# Altium project MCU098_LP-MSPM0G3507.PrjPcb (part 2 of 4)

## Sheet MCU098_02_BoosterPack_Connectors.SchDoc: BoosterPack Connectors
size 431 x 279 mm; Date: Not shown in title block; ApprovedBy: Not shown in title block; CheckedBy: Not shown in title block; Author: Not shown in title block; CompanyName: Not shown in title block; DrawnBy: Johnson He; Engineer: Not shown in title block; Organization: Not shown in title block; Address1: Not shown in title block; Address2: Not shown in title block; Address3: Not shown in title block; Address4: Not shown in title block; DocumentNumber: 1; Revision: Use project parameter SCH_Rev; SheetNumber: 2; SheetTotal: 7; PageSetup: Record=PageOptions|CenterHorizontal=True|CenterVertical=True|PrintScale=1.00|XCorrection=1.00|YCorrection=1.00|PrintKind=0|BorderSize=5000000|LeftOffset=0|BottomOffset=0|Orientation=2|PaperLength=1000|PaperWidth=1000|Scale=100|PaperSource=15|PrintQuality=600|MediaType=1|DitherType=10|PaperKind=Letter|PrintScaleMode=1; CurrentTime: Not shown in title block; CurrentDate: Not shown in title block; Time: Not shown in title block; DocumentFullPathAndName: Not shown in title block; DocumentName: Not shown in title block; ModifiedDate: Not shown in title block; ImagePath: Not shown in title block
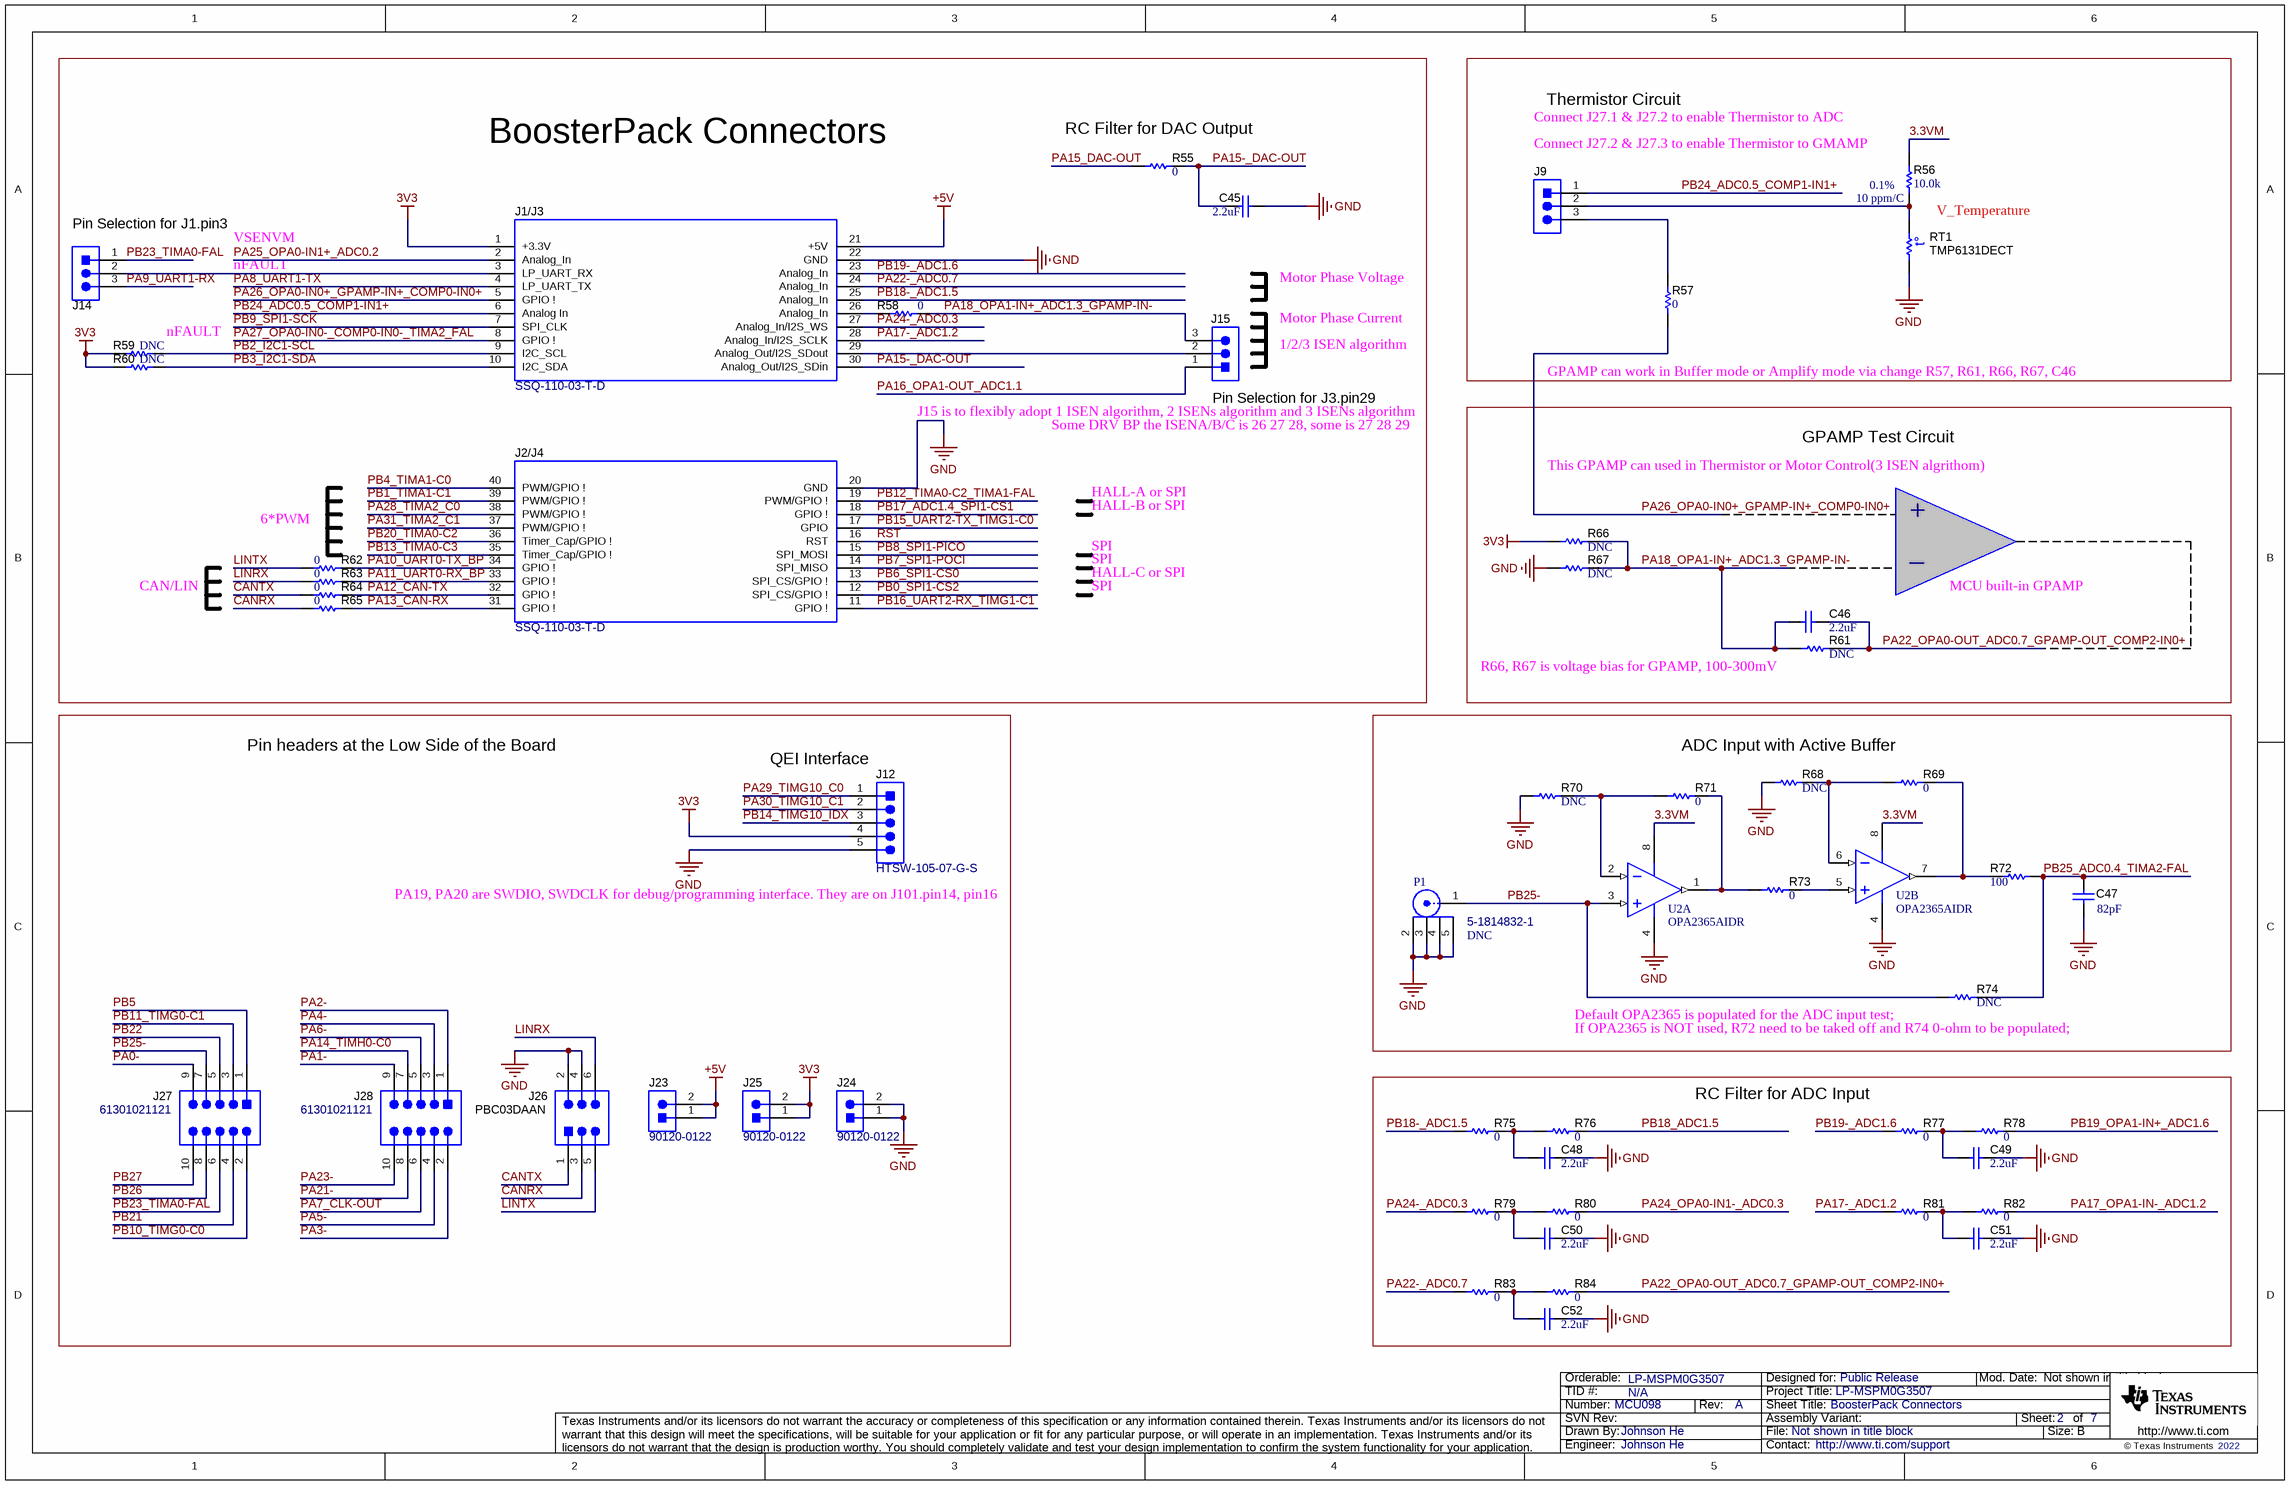
[diagram p1: MCU098_02_BoosterPack_Connectors.SchDoc]

### Parts
C45  ValueDisplayed: 2.2uF  [0603]  (hidden comment: C0603C225K8PACTU)  (no BOM)
C46  ValueDisplayed: 2.2uF  [0603]  (hidden comment: C0603C225K8PACTU)  (no BOM)
C47  ValueDisplayed: 82pF  [0603]  (hidden comment: C0603C820K5GACTU)
C48  ValueDisplayed: 2.2uF  [0603]  (hidden comment: C0603C225K8PACTU)  (no BOM)
C49  ValueDisplayed: 2.2uF  [0603]  (hidden comment: C0603C225K8PACTU)  (no BOM)
C50  ValueDisplayed: 2.2uF  [0603]  (hidden comment: C0603C225K8PACTU)  (no BOM)
C51  ValueDisplayed: 2.2uF  [0603]  (hidden comment: C0603C225K8PACTU)  (no BOM)
C52  ValueDisplayed: 2.2uF  [0603]  (hidden comment: C0603C225K8PACTU)  (no BOM)
J1/J3  SSQ-110-03-T-D  [BoosterPack_40pin_J1J3]
J2/J4  SSQ-110-03-T-D  [BoosterPack_40pin_J2J4]
J9  PEC03SAAN  [CONN_PEC03SAAN]  (value not drawn)
J12  HTSW-105-07-G-S  [Samtec_HTSW-105-07-G-S]  (net tie, no BOM)
J14  PEC03SAAN  [CONN_PEC03SAAN]  (value not drawn)
J15  PEC03SAAN  [CONN_PEC03SAAN]  (value not drawn)
J23  90120-0122  [CONN_90120-0122]  (no BOM)
J24  90120-0122  [CONN_90120-0122]  (no BOM)
J25  90120-0122  [CONN_90120-0122]  (no BOM)
J26  PBC03DAAN  [Sullins_PBC03DAAN]  (no BOM)
J27  61301021121  [WURTH_61301021121]  (no BOM)
J28  61301021121  [WURTH_61301021121]  (no BOM)
P1  5-1814832-1  ValueDisplayed: DNC  [TE_5-1814832-1]  (no BOM)
R55  ValueDisplayed: 0  [0603]  (hidden comment: RC0603JR-070RL)
R56  Tolerance_%: 0.1%  TempCo: 10 ppm/C  ValueDisplayed: 10.0k  [ERA3A]  (hidden comment: ERA3ARB103V)
R57  ValueDisplayed: 0  [0603]  (hidden comment: RC0603JR-070RL)
R58  ValueDisplayed: 0  [0603]  (hidden comment: RC0603JR-070RL)
R59  ValueDisplayed: DNC  [0402]  (hidden comment: CRCW04024K70JNED)  (no BOM)
R60  ValueDisplayed: DNC  [0402]  (hidden comment: CRCW04024K70JNED)  (no BOM)
R61  ValueDisplayed: DNC  [0603]  (hidden comment: RC0603JR-070RL)  (no BOM)
R62  ValueDisplayed: 0  [0603]  (hidden comment: RC0603JR-070RL)
R63  ValueDisplayed: 0  [0603]  (hidden comment: RC0603JR-070RL)
R64  ValueDisplayed: 0  [0603]  (hidden comment: RC0603JR-070RL)
R65  ValueDisplayed: 0  [0603]  (hidden comment: RC0603JR-070RL)
R66  ValueDisplayed: DNC  [0603]  (hidden comment: RC0603JR-070RL)  (no BOM)
R67  ValueDisplayed: DNC  [0603]  (hidden comment: RC0603JR-070RL)  (no BOM)
R68  ValueDisplayed: DNC  [0603]  (hidden comment: RC0603JR-070RL)  (no BOM)
R69  ValueDisplayed: 0  [0603]  (hidden comment: RC0603JR-070RL)
R70  ValueDisplayed: DNC  [0603]  (hidden comment: RC0603JR-070RL)  (no BOM)
R71  ValueDisplayed: 0  [0603]  (hidden comment: RC0603JR-070RL)
R72  ValueDisplayed: 100  [0603]  (hidden comment: RC0603FR-07100RL)
R73  ValueDisplayed: 0  [0603]  (hidden comment: RC0603JR-070RL)
R74  ValueDisplayed: DNC  [0603]  (hidden comment: RC0603JR-070RL)  (no BOM)
R75  ValueDisplayed: 0  [0603]  (hidden comment: RC0603JR-070RL)
R76  ValueDisplayed: 0  [0603]  (hidden comment: RC0603JR-070RL)
R77  ValueDisplayed: 0  [0603]  (hidden comment: RC0603JR-070RL)
R78  ValueDisplayed: 0  [0603]  (hidden comment: RC0603JR-070RL)
R79  ValueDisplayed: 0  [0603]  (hidden comment: RC0603JR-070RL)
R80  ValueDisplayed: 0  [0603]  (hidden comment: RC0603JR-070RL)
R81  ValueDisplayed: 0  [0603]  (hidden comment: RC0603JR-070RL)
R82  ValueDisplayed: 0  [0603]  (hidden comment: RC0603JR-070RL)
R83  ValueDisplayed: 0  [0603]  (hidden comment: RC0603JR-070RL)
R84  ValueDisplayed: 0  [0603]  (hidden comment: RC0603JR-070RL)
RT1  TMP6131DECT  [DEC0002A]
U2  OPA2365AIDR  [D0008A_L]  (parts A,B of 2)

### Blocks framed on the sheet
BoosterPack Connectors: C45 J1/J3 J2/J4 J14 J15 R55 R58-R60 R62-R65
Thermistor Circuit: J9 R56 R57 RT1
ADC Input with Active Buffer: C47 P1 R68-R74 U2
RC Filter for ADC Input: C48-C52 R75-R84

### Nets
3V3: J1/J3.1(+3.3V) J12.4 J25.1 J25.2 R59.1 R60.1 R66.1
+5V: J1/J3.21(+5V) J23.1 J23.2
GND: C45.2 C47.2 C48.2 C49.2 C50.2 C51.2 C52.2 J1/J3.22(GND) J2/J4.20(GND) J12.5 J24.1 J24.2 J26.2 J26.4 P1.2 P1.3 P1.4 P1.5 R67.1 R68.1 R70.1 RT1.1 U2.4(V-)
3.3VM: R56.2 U2.8(V+)
CANRX: J26.3 R65.1
CANTX: J26.1 R64.1
LINRX: J26.6 R63.1
LINTX: J26.5 R62.1
PA0-: J27.9
PA1-: J28.9
PA2-: J28.1
PA3-: J28.2
PA4-: J28.3
PA5-: J28.4
PA6-: J28.5
PA7_CLK-OUT: J28.6
PA8_UART1-TX: J1/J3.4(LP_UART_TX)
PA9_UART1-RX: J14.3
PA10_UART0-TX_BP: J2/J4.34(GPIO_!) R62.2
PA11_UART0-RX_BP: J2/J4.33(GPIO_!) R63.2
PA12_CAN-TX: J2/J4.32(GPIO_!) R64.2
PA13_CAN-RX: J2/J4.31(GPIO_!) R65.2
PA14_TIMH0-C0: J28.7
PA15-_DAC-OUT: C45.1 J1/J3.30(Analog_Out/I2S_SDin) R55.2
PA15_DAC-OUT: R55.1
PA16_OPA1-OUT_ADC1.1: J15.1
PA17-_ADC1.2: J1/J3.28(Analog_In/I2S_SCLK) R81.1
PA17_OPA1-IN-_ADC1.2: R82.2
PA18_OPA1-IN+_ADC1.3_GPAMP-IN-: C46.1 J15.3 R58.2 R61.1 R66.2 R67.2
PA21-: J28.8
PA22-_ADC0.7: J1/J3.24(Analog_In) R83.1
PA22_OPA0-OUT_ADC0.7_GPAMP-OUT_COMP2-IN0+: C46.2 R61.2 R84.2
PA23-: J28.10
PA24-_ADC0.3: J1/J3.27(Analog_In/I2S_WS) R79.1
PA24_OPA0-IN1-_ADC0.3: R80.2
PA25_OPA0-IN1+_ADC0.2: J1/J3.2(Analog_In)
PA26_OPA0-IN0+_GPAMP-IN+_COMP0-IN0+: J1/J3.5(GPIO_!) R57.1
PA27_OPA0-IN0-_COMP0-IN0-_TIMA2_FAL: J1/J3.8(GPIO_!)
PA28_TIMA2_C0: J2/J4.38(PWM/GPIO_!)
PA29_TIMG10_C0: J12.1
PA30_TIMG10_C1: J12.2
PA31_TIMA2_C1: J2/J4.37(PWM/GPIO_!)
PB0_SPI1-CS2: J2/J4.12(SPI_CS/GPIO_!)
PB1_TIMA1-C1: J2/J4.39(PWM/GPIO_!)
PB2_I2C1-SCL: J1/J3.9(I2C_SCL) R59.2
PB3_I2C1-SDA: J1/J3.10(I2C_SDA) R60.2
PB4_TIMA1-C0: J2/J4.40(PWM/GPIO_!)
PB5: J27.1
PB6_SPI1-CS0: J2/J4.13(SPI_CS/GPIO_!)
PB7_SPI1-POCI: J2/J4.14(SPI_MISO)
PB8_SPI1-PICO: J2/J4.15(SPI_MOSI)
PB9_SPI1-SCK: J1/J3.7(SPI_CLK)
PB10_TIMG0-C0: J27.2
PB11_TIMG0-C1: J27.3
PB12_TIMA0-C2_TIMA1-FAL: J2/J4.19(PWM/GPIO_!)
PB13_TIMA0-C3: J2/J4.35(Timer_Cap/GPIO_!)
PB14_TIMG10_IDX: J12.3
PB15_UART2-TX_TIMG1-C0: J2/J4.17(GPIO)
PB16_UART2-RX_TIMG1-C1: J2/J4.11(GPIO_!)
PB17_ADC1.4_SPI1-CS1: J2/J4.18(GPIO_!)
PB18-_ADC1.5: J1/J3.25(Analog_In) R75.1
PB18_ADC1.5: R76.2
PB19-_ADC1.6: J1/J3.23(Analog_In) R77.1
PB19_OPA1-IN+_ADC1.6: R78.2
PB20_TIMA0-C2: J2/J4.36(Timer_Cap/GPIO_!)
PB21: J27.4
PB22: J27.5
PB23_TIMA0-FAL: J14.1 J27.6
PB24_ADC0.5_COMP1-IN1+: J1/J3.6(Analog_In) J9.1
PB25-: J27.7 P1.1 R74.1 U2.3(IN_A+)
PB25_ADC0.4_TIMA2-FAL: C47.1 R72.2 R74.2
PB26: J27.8
PB27: J27.10
~{RST}: J2/J4.16(RST)
NetC48_1: C48.1 R75.2 R76.1
NetC49_1: C49.1 R77.2 R78.1
NetC50_1: C50.1 R79.2 R80.1
NetC51_1: C51.1 R81.2 R82.1
NetC52_1: C52.1 R83.2 R84.1
NetJ1/J3_3: J1/J3.3(LP_UART_RX) J14.2
NetJ1/J3_26: J1/J3.26(Analog_In) R58.1
NetJ1/J3_29: J1/J3.29(Analog_Out/I2S_SDout) J15.2
NetJ9_2: J9.2 R56.1 RT1.2
NetJ9_3: J9.3 R57.2
NetR68_2: R68.2 R69.1 U2.6(IN_B-)
NetR69_2: R69.2 R72.1 U2.7(VOUT_B)
NetR70_2: R70.2 R71.1 U2.2(IN_A-)
NetR71_2: R71.2 R73.1 U2.1(VOUT_A)
NetR73_2: R73.2 U2.5(IN_B+)

### Notes on the sheet
- (near R55) RC Filter for DAC Output
- Connect J27.1 & J27.2 to enable Thermistor to ADC
- (near R56) Connect J27.2 & J27.3 to enable Thermistor to GMAMP
- (near J14) Pin Selection for J1.pin3
- V_Temperature
- VSENVM
- nFAULT
- Motor Phase Voltage
- Motor Phase Current
- 1/2/3 ISEN algorithm
- (near J15) J15 is to flexibly adopt 1 ISEN algorithm, 2 ISENs algorithm and 3 ISENs algorithm
- (near J15) Some DRV BP the ISENA/B/C is 26 27 28, some is 27 28 29
- (near J15) Pin Selection for J3.pin29
- (near R57) GPAMP can work in Buffer mode or Amplify mode via change R57, R61, R66, R67, C46
- HALL-A or SPI
- This GPAMP can used in Thermistor or Motor Control(3 ISEN algrithom)
- GPAMP Test Circuit
- 6*PWM
- HALL-B or SPI
- SPI
- _
- +
- CAN/LIN
- HALL-C or SPI
- MCU built-in GPAMP
- (near R61) R66, R67 is voltage bias for GPAMP, 100-300mV
- Pin headers at the Low Side of the Board
- (near J12) QEI Interface
- (near J12) PA19, PA20 are SWDIO, SWDCLK for debug/programming interface. They are on J101.pin14, pin16
- (near R74) Default OPA2365 is populated for the ADC input test;
- (near R74) If OPA2365 is NOT used, R72 need to be taked off and R74 0-ohm to be populated;
- Drawn By:
- SVN Rev:
- Number:
- TID #:
- Orderable:
- Rev:
- Sheet Title:
- File:
- Project Title:
- Designed for:
- Assembly Variant:
- Mod. Date:
- Sheet:
- Size:
- of
- B
- http://www.ti.com
- Texas Instruments and/or its licensors do not warrant the accuracy or completeness of this specification or any information contained therein. Texas Instruments and/or its licensors do not warrant that this design will meet the specifications, will be suitable for your application or fit for any particular purpose, or will operate in an implementation. Texas Instruments and/or its licensors do not warrant that the design is production worthy. You should completely validate and test your design implementation to confirm the system functionality for your application.
- Engineer:
- Contact:
- © Texas Instruments
- (in symbol CMP-0084565-1) t°

### Library data of the parts
C45 C46 C48-C52 = CMP-0006906-5: CAP, CERM, 2.2 uF, 10 V, +/- 10%, X5R, 0603; Manufacturer: Kemet; TaMin_C: -55°C; Polarized: N; SizeAreaWB_mm2: 4.68; Value1: Unknown; U/M: EA; Value: 2.2uF; TaMax_C: 85°C; SizeZ_mm: 1; SizeX_mm: 1.6; SizeY_mm: 0.8; Value2: 10V; SizeArea_mm2: 1.28; Cap_F: 2.2µF; AEC Category: Q200; Publisher: Texas Instruments; TempCo: X5R; Published: 2008-06-19; RoHS: Y; MountType: SMT; Supplier 1: Digi-Key; PackageReference: 0603; Tolerance_%: 10%; Cap_Case: 0603; CompType: Capacitor; LatestRevisionDate: 2017-03-09; PartNumber: C0603C225K8PACTU; AEC Qualified: ?; VDC_V: 10V; ComponentLink1Description: Datasheet link; Supplier Part Number 1: 399-4911-1-ND; Technology: Ceramic; ComponentLink1URL: http://www.kemet.com/kemet/web/homepage/kechome.nsf/vapubfiles/F3102_Y5V.pdf/$file/F3102_Y5V.pdf; Supplier 2: Mouser; Supplier 3: Farnell; Supplier Part Number 2: 80-C0603C225K8P; Supplier Part Number 3: 1108322
C47 = CMP-0006970-1: CAP, CERM, 82 pF, 50 V, +/- 10%, C0G/NP0, 0603; Manufacturer: Kemet; TaMin_C: -55°C; Polarized: N; SizeAreaWB_mm2: 4.68; Value1: Unknown; U/M: EA; Value: 82pF; TaMax_C: 125°C; SizeZ_mm: 1; SizeX_mm: 1.6; SizeY_mm: 0.8; Value2: 50V; SizeArea_mm2: 1.28; AEC Category: Q200; ComponentLink1URL: http://www.kemet.com/kemet/web/homepage/kechome.nsf/vapubfiles/F3102_Y5V.pdf/$file/F3102_Y5V.pdf; Supplier Part Number 2: 80-C0603C820K5G; Publisher: Texas Instruments; Supplier 2: Mouser; TempCo: C0G/NP0; Published: 2008-06-19; RoHS: Y; MountType: SMT; Supplier 1: Digi-Key; PackageReference: 0603; Tolerance_%: 10%; Cap_Case: 0603; CompType: Capacitor; LatestRevisionDate: 2017-03-09; PartNumber: C0603C820K5GACTU; AEC Qualified: ?; Cap_F: 82pF; VDC_V: 50V; ComponentLink1Description: Datasheet link; Supplier Part Number 1: 399-1059-1-ND; Technology: Ceramic
J1/J3 = CMP-0003837-4: Receptacle, 2.54mm, 10x2, Tin, TH; Alternate PartNumber: CRD-081413-A-G; Manufacturer: Samtec; Alternate Manufacturer: Major League Electronics; Note: Booster Pack 40 pin J1 and J3; Green_Lifecycle: Active; Green_REACh: Incomplete; Supplier 1: Digi-Key; CompType: Receptacle; PackageReference: 10x2 Receptacle; RoHS: Y; Supplier Part Number 1: SAM1204-10-ND; MountType: TH; PartNumber: SSQ-110-03-T-D; ComponentLink1Description: Datasheet Link; ComponentLink1URL: https://www.samtec.com/ftppub/cpdf/SSQ-1XX-XX-XXX-X-XX-XXX-XX-X-MKT.pdf; Supplier 2: Newark; Supplier Part Number 2: 11P8392; Green_EU RoHS: Passed; Green_EU RoHS-2: Passed
J2/J4 = CMP-0078266-4: Receptacle, 2.54mm, 10x2, Tin, TH; Alternate PartNumber: CRD-081413-A-G; Manufacturer: Samtec; Alternate Manufacturer: Major League Electronics; Note: Booster Pack 40 pin J2 and J4; Green_REACh: Incomplete; Green_Lifecycle: Active; Green_EU RoHS-2: Passed; CompType: Receptacle; Supplier 1: Digi-Key; PackageReference: 10x2 Receptacle; RoHS: Y; Supplier Part Number 1: SAM1204-10-ND; PartNumber: SSQ-110-03-T-D; MountType: TH; ComponentLink1Description: Datasheet Link; Green_EU RoHS: Passed; ComponentLink1URL: https://www.samtec.com/ftppub/cpdf/SSQ-1XX-XX-XXX-X-XX-XXX-XX-X-MKT.pdf; Supplier 2: Newark; Supplier Part Number 2: 11P8392
J9 J14 J15 = CMP-0002338-1: Header, 100mil, 3x1, Tin, TH; Manufacturer: Sullins Connector Solutions; CNHeader: TRUE; Current_A: 3A; Green_Lifecycle: Not Set; Shrouded: N; Gender: Male; Green_REACh: Incomplete; Voltage_V: 1.8kV; Row_Count: 1; Pitch_mm: 2.54; CT: FALSE; Cert_UL: Y; ComponentLink1URL: http://www.sullinscorp.com/catalogs/77_PAGE108-109_.100_MALE_HDR.pdf; ClassName: Header; Publisher: Texas Instruments; Color: Black; RoHS: Y; MountType: TH; Green_EU RoHS-2: Incomplete; Supplier 1: Digi-Key; Green_EU RoHS: Incomplete; PackageReference: Header, 3 PIN, 100mil, Tin; PinCount: 3; CompType: Header; LatestRevisionDate: 26/05/2017; PartNumber: PEC03SAAN; Orientation: Vertical; ComponentLink1Description: Datasheet URL; Supplier Part Number 1: S1012E-03-ND; ContactFinish: Tin
J12 = CMP-0075485-1: Header, 100mil, 5x1, Gold, TH; Manufacturer: Samtec; Green_REACh: Passed; CT: False; Green_Lifecycle: Active; CNHeader: True; ComponentLink1Description: Datasheet URL; RoHS: Y; Supplier Part Number 3: 1926325; Supplier 1: Digi-Key; Green_EU RoHS: Passed; PackageReference: Header, 100mil, 5x1, TH; PartNumber: HTSW-105-07-G-S; Publisher: Texas Instruments; Supplier Part Number 2: 60R3871; Supplier 2: Newark; ClassName: Header; ComponentLink1URL: http://www.samtec.com/ftppub/pdf/TSW_TH.PDF; LatestRevisionDate: 2017-07-12; CompType: Header; MountType: TH; Supplier Part Number 1: SAM8737-ND; Supplier 3: Farnell; Green_EU RoHS-2: Passed
J23-J25 = CMP-0055312-1: Header, 100mil, 2x1, Tin, TH; Manufacturer: Molex; CNHeader: TRUE; Green_Lifecycle: Active; Green_REACh: Passed; CT: FALSE; ComponentLink1URL: http://www.molex.com/pdm_docs/sd/901200122_sd.pdf; ClassName: Header; Supplier Part Number 2: 19M8215; Publisher: Texas Instruments; Supplier 2: Newark; Supplier Part Number 3: 538-90120-0122; Supplier 3: Mouser; RoHS: Y; MountType: TH; Green_EU RoHS-2: Passed; Supplier 1: Digi-Key; Green_EU RoHS: Passed; PackageReference: Header 2x1; CompType: Header; LatestRevisionDate: 26/05/2017; PartNumber: 90120-0122; ComponentLink1Description: Datasheet URL; Supplier Part Number 1: WM8072-ND
J26 = CMP-0054565-2: Header, 100mil, 3x2, Gold, TH; Manufacturer: Sullins Connector Solutions; Current_A: 3A; Green_Lifecycle: Active; Shrouded: N; Gender: Male; Green_REACh: Passed; Voltage_V: 1.8kV; Row_Count: 2; RowSpacing_mm: 2.54; Cert_UL: Y; ComponentLink1URL: http://www.sullinscorp.com/catalogs/77_PAGE108-109_.100_MALE_HDR.pdf; ClassName: Header; Color: Black; RoHS: Y; MountType: TH; Green_EU RoHS-2: Passed; Supplier 1: Digi-Key; Green_EU RoHS: Passed; PackageReference: Sullins 100mil, 2x3, 230 mil above insulator; PinCount: 6; CompType: Header; PartNumber: PBC03DAAN; Orientation: Vertical; ComponentLink1Description: Datasheet URL; Supplier Part Number 1: S2011E-03-ND; Pitch_mm: 2.54; ContactFinish: Gold
J27 J28 = CMP-0054806-2: Header, 2.54 mm, 5x2, Gold, TH; Manufacturer: Wurth Elektronik; Green_Lifecycle: Active; Green_REACh: Passed; Cert_UL: Y; Current_A: 3A; Gender: Male; Pitch_mm: 2.54; Row_Count: 2; Shrouded: N; Voltage_V: 250V; ComponentLink1URL: http://katalog.we-online.de/em/datasheet/6130xx21121.pdf; ClassName: Header; Supplier Part Number 2: 16T0631; Supplier 2: Newark; Supplier Part Number 3: 710-61301021121; Supplier 3: Mouser; RoHS: Y; MountType: TH; Green_EU RoHS-2: Incomplete; Supplier 1: Digi-Key; Green_EU RoHS: Passed; PackageReference: Header, 2.54mm, 5x2, TH; CompType: Header; PartNumber: 61301021121; ComponentLink1Description: Datasheet URL; Supplier Part Number 1: 732-2672-ND; ContactFinish: Gold; Orientation: Vertical; PinCount: 10; RowSpacing_mm: 2.54
P1 = CMP-0054990-1: SMA Straight PCB Socket Die Cast, 50 Ohm, TH; Manufacturer: TE Connectivity; CNHeader: FALSE; Green_Lifecycle: Active; Green_REACh: Passed; CT: TRUE; ComponentLink1URL: http://www.te.com/commerce/DocumentDelivery/DDEController?Action=srchrtrv&DocNm=1814832&DocType=Customer+Drawing&DocLang=English; Supplier Part Number 2: 78M7270; Publisher: Texas Instruments; Supplier 2: Newark; Supplier Part Number 3: 571-5-1814832-1; Supplier 3: Mouser; RoHS: Y; MountType: TH; Green_EU RoHS-2: Incomplete; Supplier 1: Digi-Key; Green_EU RoHS: Passed with Exemption; PackageReference: SMA Straight PCB Socket Die Cast, TH; CompType: SMA; LatestRevisionDate: 26/05/2017; PartNumber: 5-1814832-1; ComponentLink1Description: Datasheet URL; Supplier Part Number 1: A97594-ND
R55 R57 R58 R61-R71 R73-R84 = CMP-0025885-5: RES, 0, 5%, 0.1 W, 0603; Manufacturer: Yageo; Power_W: 100mW; TempCo: 200 ppm/C; Value_Code: 0000; Value: 0; EIA_Code: E24; SizeX_mm: 1.6; SizeZ_mm: 1; Value2: 0.1W; SizeArea_mm2: 1.28; AEC Qualified: N; VDC_V: 75V; AEC Category: Q200; SizeY_mm: 0.8; SizeAreaWB_mm2: 4.68; Supplier Part Number 2: 603-RC0603JR-070RL; Supplier 2: Mouser; Supplier Part Number 3: 9233130; Supplier 3: Farnell; RoHS: Y; Value1: 5%; MountType: SMT; Supplier 1: Digi-Key; PackageReference: 0603; Tolerance_%: 5%; Res_ohm: 0; CompType: Resistor; PartNumber: RC0603JR-070RL; ComponentLink1Description: Datasheet link; Supplier Part Number 1: 311-0.0GRCT-ND; Technology: Thick Film; ComponentLink1URL: http://www.yageo.com/pdf/Pu-RC0603_51_PbFree_L_2.pdf; AEC Grade: N/A
R56 = CMP-0080084-1: RES, 10.0 k, 0.1%, 0.1 W, AEC-Q200 Grade 0, 1.6x0.8mm; Manufacturer: Panasonic; Value_Code: 10k0; SizeAreaWB_mm2: 4.68; SizeArea_mm2: 1.28; AEC Qualified: Y; AEC Category: Q200; Res_ohm: 10k; Value: 10.0k; SizeZ_mm: 0.55; AEC Grade: 0; Power_W: 100mW; VDC_V: 150V; SizeY_mm: 0.8; Value2: 0.1W; SizeX_mm: 1.6; ComponentLink1Description: Datasheet link; RoHS: Y; Supplier Part Number 3: 667-ERA-3ARB103V; Supplier 1: Digi-Key; PackageReference: 1.6x0.8mm; Technology: Thin Film; PartNumber: ERA3ARB103V; Supplier Part Number 2: 62W8891; Supplier 2: Newark; ComponentLink1URL: https://industrial.panasonic.com/cdbs/www-data/pdf/RDM0000/AOA0000C307.pdf; Value1: 0.1%; CompType: Resistor; MountType: SMT; Supplier Part Number 1: P10KBDCT-ND; Supplier 3: Mouser
R59 R60 = CMP-0026938-5: RES, 4.7 k, 5%, 0.063 W, AEC-Q200 Grade 0, 0402; Manufacturer: Vishay-Dale; Power_W: 63mW; TempCo: 200 ppm/C; Value_Code: 4k70; Value: 4.7k; EIA_Code: E24; SizeX_mm: 1; SizeY_mm: 0.5; SizeZ_mm: 0.6; Value2: 0.063W; AEC Qualified: Y; VDC_V: 50V; AEC Category: Q200; AEC Grade: 0; Supplier Part Number 2: 59M6733; Supplier 2: Newark; Supplier Part Number 3: 71-CRCW0402J-4.7K-E3; Supplier 3: Mouser; RoHS: E; Value1: 5%; MountType: SMT; Supplier 1: Digi-Key; PackageReference: 0402; Tolerance_%: 5%; Res_ohm: 4.7k; SizeArea_mm2: 0.5; CompType: Resistor; PartNumber: CRCW04024K70JNED; ComponentLink1Description: Datasheet link; Supplier Part Number 1: 541-4.7KJCT-ND; Technology: Thick Film; ComponentLink1URL: http://www.vishay.com/docs/20035/dcrcwe3.pdf
R72 = CMP-0022736-4: RES, 100, 1%, 0.1 W, 0603; Manufacturer: Yageo; Power_W: 100mW; TempCo: 100 ppm/C; Value_Code: 100R; Value: 100; EIA_Code: E96; SizeX_mm: 1.6; SizeY_mm: 0.8; SizeZ_mm: 1; Value2: 0.1W; SizeArea_mm2: 1.28; AEC Qualified: N; VDC_V: 75V; AEC Category: Q200; SizeAreaWB_mm2: 4.68; ComponentLink1URL: http://www.yageo.com/pdf/Pu-RC0603_51_PbFree_L_2.pdf; Supplier Part Number 2: 603-RC0603FR-07100RL; Supplier 2: Mouser; Supplier Part Number 3: 9238360; Supplier 3: Farnell; RoHS: Y; Value1: 1%; MountType: SMT; Supplier 1: Digi-Key; PackageReference: 0603; Tolerance_%: 1%; Res_ohm: 100; CompType: Resistor; PartNumber: RC0603FR-07100RL; ComponentLink1Description: Datasheet link; Supplier Part Number 1: 311-100HRCT-ND; Technology: Thick Film; AEC Grade: N/A
RT1 = CMP-0084565-1: Thermistor, DEC0002A (X1SON-2); Alternate Manufacturer: Texas Instruments; Alternate PartNumber: TMP6131DECR; SizeZ_mm: 0.5; CompType: IC; AEC Category: Q200; SizeArea_mm2: 0.6; AEC Qualified: N; SizeX_mm: 1; SizeAreaWB_mm2: 3.2; ComponentLink3Description: Online Datasheet; PackageReference: DEC0002A; ComponentLink2Description: Product Folder; ComponentLink3URL: http://www.ti.com/product/tmp6/datasheet; MountType: SMT; PackageDescription: X1SON-2; ComponentLink2URL: http://www.ti.com/product/tmp6; PartNumber: TMP6131DECT; ComponentLink1URL: http://www.ti.com/lit/ds/symlink/tmp6.pdf; ComponentLink1Description: Datasheet Link; SizeY_mm: 0.6; Manufacturer: Texas Instruments
U2 = CMP-0040798-2: 50 MHz, Low-Noise Single-Supply Rail-to-Rail Operational Amplifier, 2.2 to 5.5 V, -40 to 125 degC, 8-pin SOIC (D8), Green (RoHS & no Sb/Br); Manufacturer: Texas Instruments; Sub Family: High Speed Amplifier (>=50MHz), Low Input Bias Current Amp (<=10pA), Low Offset Voltage Amplifier (<=500uV), Low Supply Voltage Amplifier (<=2.7V); Total Supply Voltage(Min)(+5V is 5, +/-5V is 10): 2.2; Slew Rate(Typ)(V/us): 25; Vio (25C)(Max)(mV): 0.2; IIB(Max)(pA): 10; Total Supply Voltage(Max)(+5V is 5, +/-5V is 10): 5.5; Offset Drift(Typ)(uV/C): 1; Iq per channel(Max)(mA): 5; CMRR(Min)(dB): 100; Number of Channels: 2; ComponentLink1URL: http://www.ti.com/; Code_JEDEC: MS-012; PackageDescription: 8-Pin Plastic Small Outline, Body 4.9 x 3.9 mm, Pitch 1.27 mm; ComponentLink2URL: http://www.ti.com/general/docs/lit/getliterature.tsp?genericPartNumber=OPA2365&fileType=pdf; ComponentLink3Description: Package Specification; Eco-Plan: Green (RoHS & no Sb/Br); ComponentLink2Description: Datasheet; ComponentLink3URL: http://www.ti.com/litv/pdf/msoi002j; PackageReference: D0008A; DatasheetVersion: SBOS365D; PartNumber: OPA2365AIDR; PackageVersion: 4040047-3/M, 06/2011; ComponentLink1Description: Manufacturer URL; Mounting Technology: Surface Mount; PartId: 1

## Sheet MCU098_03_XDS110_Debug_Probe.SchDoc: XDS110-ET Debug Probe
size 431 x 279 mm; Date: Not shown in title block; ApprovedBy: Not shown in title block; CheckedBy: Not shown in title block; Author: Not shown in title block; CompanyName: Not shown in title block; DrawnBy: Johnson He; Engineer: Not shown in title block; Organization: Not shown in title block; Address1: Not shown in title block; Address2: Not shown in title block; Address3: Not shown in title block; Address4: Not shown in title block; DocumentNumber: 1; Revision: Use project parameter SCH_Rev; SheetNumber: 3; SheetTotal: 7; PageSetup: Record=PageOptions|CenterHorizontal=True|CenterVertical=True|PrintScale=1.00|XCorrection=1.00|YCorrection=1.00|PrintKind=0|BorderSize=5000000|LeftOffset=0|BottomOffset=0|Orientation=2|PaperLength=1000|PaperWidth=1000|Scale=100|PaperSource=15|PrintQuality=600|MediaType=1|DitherType=10|PaperKind=Letter|PrintScaleMode=1; CurrentTime: Not shown in title block; CurrentDate: Not shown in title block; Time: Not shown in title block; DocumentFullPathAndName: Not shown in title block; DocumentName: Not shown in title block; ModifiedDate: Not shown in title block; ImagePath: Not shown in title block
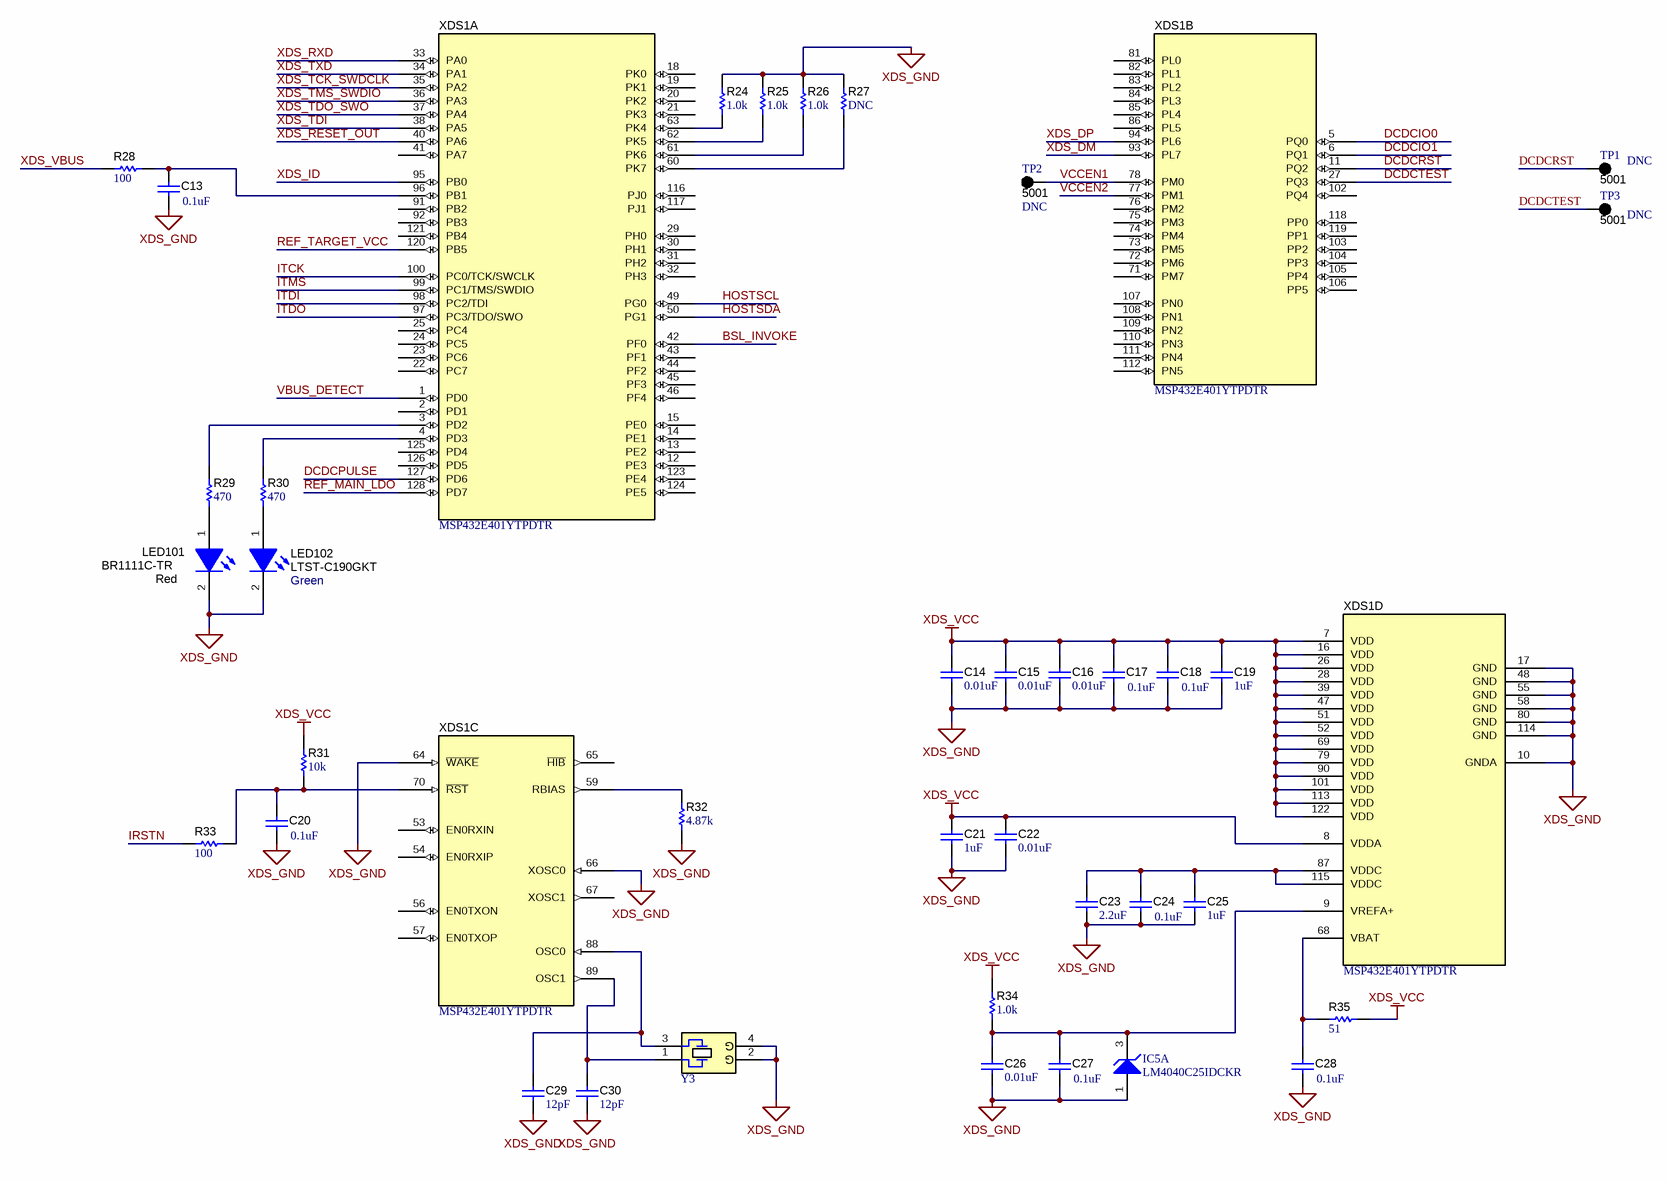
[diagram p2: MCU098_03_XDS110_Debug_Probe.SchDoc]

### Parts
C13  ValueDisplayed: 0.1uF  [0402]  (hidden comment: GRM155R70J104KA01D)
C14  ValueDisplayed: 0.01uF  [0402]  (hidden comment: GRM155R71E103KA01D)
C15  ValueDisplayed: 0.01uF  [0402]  (hidden comment: GRM155R71E103KA01D)
C16  ValueDisplayed: 0.01uF  [0402]  (hidden comment: GRM155R71E103KA01D)
C17  ValueDisplayed: 0.1uF  [0402]  (hidden comment: GRM155R70J104KA01D)
C18  ValueDisplayed: 0.1uF  [0402]  (hidden comment: GRM155R70J104KA01D)
C19  ValueDisplayed: 1uF  [0402]  (hidden comment: C1005X5R1E105K050BC)
C20  ValueDisplayed: 0.1uF  [0402]  (hidden comment: GRM155R70J104KA01D)
C21  ValueDisplayed: 1uF  [0402]  (hidden comment: C1005X5R1E105K050BC)
C22  ValueDisplayed: 0.01uF  [0402]  (hidden comment: GRM155R71E103KA01D)
C23  ValueDisplayed: 2.2uF  [0402]  (hidden comment: GRM155R60J225KE95D)
C24  ValueDisplayed: 0.1uF  [0402]  (hidden comment: GRM155R70J104KA01D)
C25  ValueDisplayed: 1uF  [0402]  (hidden comment: C1005X5R1E105K050BC)
C26  ValueDisplayed: 0.01uF  [0402]  (hidden comment: GRM155R71E103KA01D)
C27  ValueDisplayed: 0.1uF  [0402]  (hidden comment: GRM155R70J104KA01D)
C28  ValueDisplayed: 0.1uF  [0402]  (hidden comment: GRM155R70J104KA01D)
C29  ValueDisplayed: 12pF  [0402]  (hidden comment: GRM1555C1H120JA01D)
C30  ValueDisplayed: 12pF  [0402]  (hidden comment: GRM1555C1H120JA01D)
IC5  LM4040C25IDCKR  [DCK0005A_N]  (part A of 2)
LED101  BR1111C-TR  value Red  [1111C_Red]
LED102  LTST-C190GKT  value Green  [LED_LTST-C190]
R24  ValueDisplayed: 1.0k  [0402]  (hidden comment: CRCW04021K00JNED)
R25  ValueDisplayed: 1.0k  [0402]  (hidden comment: CRCW04021K00JNED)
R26  ValueDisplayed: 1.0k  [0402]  (hidden comment: CRCW04021K00JNED)
R27  ValueDisplayed: DNC  [0402]  (hidden comment: CRCW04021K00JNED)  (no BOM)
R28  ValueDisplayed: 100  [0402]  (hidden comment: CRCW0402100RJNED)
R29  ValueDisplayed: 470  [0402]  (hidden comment: CRCW0402470RJNED)
R30  ValueDisplayed: 470  [0402]  (hidden comment: CRCW0402470RJNED)
R31  ValueDisplayed: 10k  [0402]  (hidden comment: CRCW040210K0JNED)
R32  ValueDisplayed: 4.87k  [0402]  (hidden comment: CRCW04024K87FKED)
R33  ValueDisplayed: 100  [0402]  (hidden comment: CRCW0402100RJNED)
R34  ValueDisplayed: 1.0k  [0402]  (hidden comment: CRCW04021K00JNED)
R35  ValueDisplayed: 51  [0402]  (hidden comment: CRCW040251R0JNED)
TP1  5001  Display: DNC  [Keystone5001]  (no BOM)
TP2  5001  Display: DNC  [Keystone5001]  (no BOM)
TP3  5001  Display: DNC  [Keystone5001]  (no BOM)
XDS1  MSP432E401YTPDTR  [PDT0128A]  (parts A,B,C,D of 4)
Y3  NX3225GA-16.000M-STD-CRG-1  [NDK_NX3225GA]  (value not drawn)

### Nets
XDS_GND: C13.2 C14.2 C15.2 C16.2 C17.2 C18.2 C19.2 C20.2 C21.2 C22.2 C23.2 C24.2 C25.2 C26.2 C27.2 C28.2 C29.2 C30.2 IC5.1(ANODE) LED101.2(K) LED102.2(K) R24.2 R25.2 R26.2 R27.2 R32.1 XDS1.10(GNDA) XDS1.17(GND) XDS1.48(GND) XDS1.55(GND) XDS1.58(GND) XDS1.64(~{WAKE}) XDS1.66(XOSC0) XDS1.80(GND) XDS1.114(GND) Y3.2(GND) Y3.4(GND)
XDS_VCC: C14.1 C15.1 C16.1 C17.1 C18.1 C19.1 C21.1 C22.1 R31.2 R34.2 R35.2 XDS1.7(VDD) XDS1.8(VDDA) XDS1.16(VDD) XDS1.26(VDD) XDS1.28(VDD) XDS1.39(VDD) XDS1.47(VDD) XDS1.51(VDD) XDS1.52(VDD) XDS1.69(VDD) XDS1.79(VDD) XDS1.90(VDD) XDS1.101(VDD) XDS1.113(VDD) XDS1.122(VDD)
BSL_INVOKE: XDS1.42(PF0)
DCDCIO0: XDS1.5(PQ0)
DCDCIO1: XDS1.6(PQ1)
DCDCPULSE: XDS1.127(PD6)
DCDCRST: TP1.1 XDS1.11(PQ2)
DCDCTEST: TP3.1 XDS1.27(PQ3)
HOSTSCL: XDS1.49(PG0)
HOSTSDA: XDS1.50(PG1)
IRSTN: R33.1
ITCK: XDS1.100(PC0/TCK/SWCLK)
ITDI: XDS1.98(PC2/TDI)
ITDO: XDS1.97(PC3/TDO/SWO)
ITMS: XDS1.99(PC1/TMS/SWDIO)
REF_MAIN_LDO: XDS1.128(PD7)
REF_TARGET_VCC: XDS1.120(PB5)
VBUS_DETECT: XDS1.1(PD0)
VCCEN1: TP2.1 XDS1.78(PM0)
VCCEN2: XDS1.77(PM1)
XDS_DM: XDS1.93(PL7)
XDS_DP: XDS1.94(PL6)
XDS_ID: XDS1.95(PB0)
XDS_RESET_OUT: XDS1.40(PA6)
XDS_RXD: XDS1.33(PA0)
XDS_TCK_SWDCLK: XDS1.35(PA2)
XDS_TDI: XDS1.38(PA5)
XDS_TDO_SWO: XDS1.37(PA4)
XDS_TMS_SWDIO: XDS1.36(PA3)
XDS_TXD: XDS1.34(PA1)
XDS_VBUS: R28.1
NetC13_1: C13.1 R28.2 XDS1.96(PB1)
NetC20_1: C20.1 R31.1 R33.2 XDS1.70(~{RST})
NetC23_1: C23.1 C24.1 C25.1 XDS1.87(VDDC) XDS1.115(VDDC)
NetC26_1: C26.1 C27.1 IC5.3(CATHODE) R34.1 XDS1.9(VREFA+)
NetC28_1: C28.1 R35.1 XDS1.68(VBAT)
NetC29_1: C29.1 XDS1.88(OSC0) Y3.3
NetC30_1: C30.1 XDS1.89(OSC1) Y3.1
NetLED101_1: LED101.1(A) R29.1
NetLED102_1: LED102.1(A) R30.1
NetR24_1: R24.1 XDS1.63(PK4)
NetR25_1: R25.1 XDS1.62(PK5)
NetR26_1: R26.1 XDS1.61(PK6)
NetR27_1: R27.1 XDS1.60(PK7)
NetR29_2: R29.2 XDS1.3(PD2)
NetR30_2: R30.2 XDS1.4(PD3)
NetR32_2: R32.2 XDS1.59(RBIAS)

Not connected (* = marked no-connect by the designer): XDS1 2(PD1) 12(PE3) 13(PE2) 14(PE1) 15(PE0) 18(PK0) 19(PK1) 20(PK2) 21(PK3) 22(PC7) 23(PC6) 24(PC5) 25(PC4) 29(PH0) 30(PH1) 31(PH2) 32(PH3) 41(PA7) 43(PF1) 44(PF2) 45(PF3) 46(PF4) 53(EN0RXIN) 54(EN0RXIP) 56(EN0TXON) 57(EN0TXOP) 65(~{HIB}) 67(XOSC1) 71(PM7) 72(PM6) 73(PM5) 74(PM4) 75(PM3) 76(PM2) 81(PL0) 82(PL1) 83(PL2) 84(PL3) 85(PL4) 86(PL5) 91(PB2) 92(PB3) 102(PQ4) 103(PP2) 104(PP3) 105(PP4) 106(PP5) 107(PN0) 108(PN1) 109(PN2) 110(PN3) 111(PN4) 112(PN5) 116(PJ0) 117(PJ1) 118(PP0) 119(PP1) 121(PB4) 123(PE4) 124(PE5) 125(PD4) 126(PD5)

### Notes on the sheet
- Drawn By:
- SVN Rev:
- Number:
- TID #:
- Orderable:
- Rev:
- Sheet Title:
- File:
- Project Title:
- Designed for:
- Assembly Variant:
- Mod. Date:
- Sheet:
- Size:
- of
- B
- http://www.ti.com
- Texas Instruments and/or its licensors do not warrant the accuracy or completeness of this specification or any information contained therein. Texas Instruments and/or its licensors do not warrant that this design will meet the specifications, will be suitable for your application or fit for any particular purpose, or will operate in an implementation. Texas Instruments and/or its licensors do not warrant that the design is production worthy. You should completely validate and test your design implementation to confirm the system functionality for your application.
- Engineer:
- Contact:
- © Texas Instruments
- (in symbol CMP-0004635-1) G

### Library data of the parts
C13 C17 C18 C20 C24 C27 C28 = CMP-0006623-2: CAP, CERM, 0.1 uF, 6.3 V, +/- 10%, X7R, 0402; Manufacturer: MuRata; TaMin_C: -55°C; Polarized: N; SizeAreaWB_mm2: 3; Value1: Unknown; U/M: EA; Value: 0.1uF; TaMax_C: 125°C; SizeZ_mm: 0.6; SizeX_mm: 1; SizeY_mm: 0.5; Value2: 6.3V; Cap_F: 100nF; AEC Category: Q200; Supplier Part Number 2: 81-GRM155R70J104KA1D; Publisher: Texas Instruments; Supplier 2: Mouser; TempCo: X7R; Published: 2008-06-19; RoHS: Y; MountType: SMT; Supplier 1: Digi-Key; PackageReference: 0402; Tolerance_%: 10%; Cap_Case: 0402; SizeArea_mm2: 0.5; CompType: Capacitor; LatestRevisionDate: 2017-03-09; PartNumber: GRM155R70J104KA01D; AEC Qualified: ?; VDC_V: 6.3V; ComponentLink1Description: Datasheet link; Supplier Part Number 1: GRM155R70J104KA01D-ND; Technology: Ceramic; ComponentLink1URL: http://search.murata.co.jp/Ceramy/PnsearchViewAction.do?HnOFG=ON&HnNFG=ON&SEL_CNT=50&sLang=en&sKey=GRM155R70J104KA01D&x=9&y=9&search=startwith
C14-C16 C22 C26 = CMP-0006658-2: CAP, CERM, 0.01 uF, 25 V, +/- 10%, X7R, 0402; Manufacturer: MuRata; TaMin_C: -55°C; Polarized: N; SizeAreaWB_mm2: 3; Value1: Unknown; U/M: EA; Value: 0.01uF; TaMax_C: 125°C; SizeZ_mm: 0.6; SizeX_mm: 1; SizeY_mm: 0.5; Value2: 25V; Cap_F: 10nF; AEC Category: Q200; Supplier Part Number 2: 81-GRM36X103K25; Publisher: Texas Instruments; Supplier 2: Mouser; Supplier Part Number 3: 8819734; TempCo: X7R; Supplier 3: Farnell; Published: 2008-06-19; RoHS: Y; MountType: SMT; Supplier 1: Digi-Key; PackageReference: 0402; Tolerance_%: 10%; Cap_Case: 0402; SizeArea_mm2: 0.5; CompType: Capacitor; LatestRevisionDate: 2017-03-09; PartNumber: GRM155R71E103KA01D; AEC Qualified: ?; VDC_V: 25V; ComponentLink1Description: Datasheet link; Supplier Part Number 1: 490-1312-1-ND; Technology: Ceramic; ComponentLink1URL: http://search.murata.co.jp/Ceramy/PnsearchViewAction.do?HnOFG=ON&HnNFG=ON&SEL_CNT=50&sLang=en&sKey=GRM155R71E103KA01D&x=9&y=9&search=startwith
C19 C21 C25 = CMP-0006276-2: CAP, CERM, 1 uF, 25 V, +/- 10%, X5R, 0402; Manufacturer: TDK; TaMin_C: -55°C; Polarized: N; SizeAreaWB_mm2: 3; Value1: Unknown; U/M: EA; Value: 1uF; TaMax_C: 80°C; SizeZ_mm: 0.6; SizeX_mm: 1; SizeY_mm: 0.5; Value2: 25V; Cap_F: 1µF; AEC Category: Q200; ComponentLink1URL: https://product.tdk.com/info/en/catalog/datasheets/mlcc_commercial_general_en.pdf; Supplier Part Number 2: 07W9127; Publisher: Texas Instruments; Supplier 2: Newark; Supplier Part Number 3: 810-C1005X5R1E105K; TempCo: X5R; Supplier 3: Mouser; Published: 2008-06-19; RoHS: Y; MountType: SMT; Supplier 1: Digi-Key; PackageReference: 0402; Tolerance_%: 10%; Cap_Case: 0402; SizeArea_mm2: 0.5; CompType: Capacitor; PartNumber: C1005X5R1E105K050BC; AEC Qualified: N; VDC_V: 25V; ComponentLink1Description: Datasheet link; Supplier Part Number 1: 445-9066-1-ND; LatestRevisionDate: 2017-03-09; Technology: Ceramic; AEC Grade: N/A
C23 = CMP-0006543-2: CAP, CERM, 2.2 uF, 6.3 V, +/- 10%, X5R, 0402; Manufacturer: MuRata; TaMin_C: -55°C; Polarized: N; SizeAreaWB_mm2: 3; Value1: Unknown; U/M: EA; Value: 2.2uF; TaMax_C: 85°C; SizeZ_mm: 0.6; SizeX_mm: 1; SizeY_mm: 0.5; Value2: 6.3V; Cap_F: 2.2µF; AEC Category: Q200; Publisher: Texas Instruments; TempCo: X5R; Published: 2008-06-19; RoHS: Y; MountType: SMT; Supplier 1: Mouser; PackageReference: 0402; Tolerance_%: 10%; Cap_Case: 0402; SizeArea_mm2: 0.5; CompType: Capacitor; LatestRevisionDate: 2017-03-09; PartNumber: GRM155R60J225KE95D; AEC Qualified: N; VDC_V: 6.3V; ComponentLink1Description: Datasheet link; AEC Grade: N/A; Supplier Part Number 1: 81-GRM155R60J225KE5D; Technology: Ceramic; ComponentLink1URL: http://psearch.en.murata.com/capacitor/product/GRM155R60J225KE95%23.pdf
C29 C30 = CMP-0006415-2: CAP, CERM, 12 pF, 50 V, +/- 5%, C0G/NP0, 0402; Manufacturer: MuRata; TaMin_C: -55°C; Polarized: N; SizeAreaWB_mm2: 3; Value1: Unknown; U/M: EA; Value: 12pF; TaMax_C: 125°C; SizeZ_mm: 0.6; SizeX_mm: 1; SizeY_mm: 0.5; Value2: 50V; AEC Category: Q200; Supplier Part Number 2: 81-GRM1555C1H120JA1D; Publisher: Texas Instruments; Supplier 2: Mouser; Supplier Part Number 3: 1828875; TempCo: C0G/NP0; Supplier 3: Farnell; Published: 2008-06-19; RoHS: Y; MountType: SMT; Supplier 1: Newark; PackageReference: 0402; Tolerance_%: 5%; Cap_Case: 0402; SizeArea_mm2: 0.5; CompType: Capacitor; LatestRevisionDate: 2017-03-09; PartNumber: GRM1555C1H120JA01D; AEC Qualified: ?; Cap_F: 12pF; VDC_V: 50V; ComponentLink1Description: Datasheet link; Supplier Part Number 1: 14T3292; Technology: Ceramic; ComponentLink1URL: http://search.murata.co.jp/Ceramy/PnsearchViewAction.do?HnOFG=ON&HnNFG=ON&SEL_CNT=50&sLang=en&sKey=GRM1555C1H120JA01D&x=9&y=9&search=startwith
IC5 = CMP-0032790-2: Precision Micropower Shunt Voltage Reference, 0.5% accuracy, 2.5 V, 15 ppm / degC, 15 mA, -40 to 85 degC, 5-pin SC70 (DCK), Green (RoHS & no Sb/Br); Manufacturer: Texas Instruments; Min Iz for Regulation(uA): 75; Temp Coeff(Max)(ppm/ degree C): 100; VO(V): 2.5; Temp Coeff(Typ)(ppm/ degree C): 15; Rating: Catalog; Initial Accuracy @ 25/deg C(%): 0.5; AEC Category: Q200; AEC Qualified: N; CompType: IC; SizeAreaWB_mm2: 9.3; SizeArea_mm2: 4.2; SizeX_mm: 2.1; SizeY_mm: 2.0; SizeZ_mm: 1.1; DatasheetVersion: SLOS456K; Code_JEDEC: MO-203; PackageDescription: SOT-SC70-5; PartNumber: LM4040C25IDCKR; ComponentLink1URL: http://www.ti.com/lit/ds/symlink/lm4040.pdf; ComponentLink2URL: http://www.ti.com/product/lm4040; ComponentLink3Description: Online Datasheet; ComponentLink1Description: Datasheet Link; ComponentLink3URL: http://www.ti.com/product/lm4040/datasheet; Iout/Iz(Max)(mA): 15; Eco-Plan: Green (RoHS & no Sb/Br); SubFamily: Shunt Voltage Reference; ComponentLink2Description: Product Folder; PackageReference: DCK0005A; MountType: SMT; RoHS: Y; PartId: 1
LED101 = CMP-0002972-3: LED, Red, SMD; Manufacturer: Stanley Electric Co., LTD; Power_TotalModule: 57.5mW; Vr_V: 4V; Value1: 0.0575W; Ir_A: 100µA; Io_A: 20mA; Value2: 1.7V; Tjmax_C: 85°C; RoHS: Y; Type: ?; ComponentLink1URL: https://sps06.itg.ti.com/sites/KMS/crossdivteams/altium/docs/ComponentDatasheets/BR1111C-TR.pdf; PackageReference: 1.6x0.8mm; PartNumber: BR1111C-TR; MountType: SMT; ComponentLink1Description: Datasheet link; CompType: LED; Color: Red; Vf_V: 1.7V
LED102 = CMP-0002827-3: LED, Green, SMD; Manufacturer: Lite-On; Power_TotalModule: 100mW; Value2: 2.1V; Io_A: 20mA; Value1: 0.1W; ComponentLink1Description: Datasheet link; PackageReference: 1.6x0.8x0.8mm; CompType: LED; Type: ?; ComponentLink1URL: https://sps06.itg.ti.com/sites/KMS/crossdivteams/altium/docs/ComponentDatasheets/LTST-C190GKT.pdf; Color: green; Vf_V: 2.1V; PartNumber: LTST-C190GKT; RoHS: Y; MountType: SMT
R24-R27 R34 = CMP-0026852-1: RES, 1.0 k, 5%, 0.063 W, 0402; Manufacturer: Vishay-Dale; Power_W: 63mW; TempCo: 200 ppm/C; Value_Code: 1k00; U/M: EA; Value: 1.0k; EIA_Code: E24; Res_ohm: 1k; SizeX_mm: 1; SizeY_mm: 0.5; SizeZ_mm: 0.6; Value2: 0.063W; VDC_V: 50V; AEC Category: Q200; ComponentLink1URL: http://www.vishay.com/docs/20035/dcrcwe3.pdf; Supplier Part Number 2: 59M6691; Publisher: Texas Instruments; Supplier 2: Newark; Supplier Part Number 3: 71-CRCW0402J-1.0K-E3; Supplier 3: Mouser; Published: 2008-06-26; RoHS: Y; Value1: 5%; MountType: SMT; Supplier 1: Digi-Key; PackageReference: 0402; Tolerance_%: 5%; SizeArea_mm2: 0.5; CompType: Resistor; LatestRevisionDate: 2017-03-09; PartNumber: CRCW04021K00JNED; AEC Qualified: ?; ComponentLink1Description: Datasheet link; Supplier Part Number 1: 541-1.0KJCT-ND; Technology: Thick Film
R28 = CMP-0026824-3: RES, 100, 5%, 0.063 W, AEC-Q200 Grade 0, 0402; Manufacturer: Vishay-Dale; Power_W: 63mW; TempCo: 200 ppm/C; Value_Code: 100R; Value: 100; EIA_Code: E24; SizeX_mm: 1; SizeY_mm: 0.5; SizeZ_mm: 0.6; Value2: 0.063W; AEC Qualified: Y; VDC_V: 50V; AEC Category: Q200; AEC Grade: 0; Supplier Part Number 2: 59M6700; Supplier 2: Newark; Supplier Part Number 3: 71-CRCW0402J-100-E3; Supplier 3: Mouser; RoHS: E; Value1: 5%; MountType: SMT; Supplier 1: Digi-Key; PackageReference: 0402; Tolerance_%: 5%; Res_ohm: 100; SizeArea_mm2: 0.5; CompType: Resistor; PartNumber: CRCW0402100RJNED; ComponentLink1Description: Datasheet link; Supplier Part Number 1: 541-100JCT-ND; Technology: Thick Film; ComponentLink1URL: http://www.vishay.com/docs/20035/dcrcwe3.pdf
R29 R30 = CMP-0026934-2: RES, 470, 5%, 0.063 W, 0402; Manufacturer: Vishay-Dale; Power_W: 63mW; TempCo: 200 ppm/C; Value_Code: 470R; U/M: EA; Value: 470; EIA_Code: E24; SizeX_mm: 1; SizeY_mm: 0.5; SizeZ_mm: 0.6; Value2: 0.063W; VDC_V: 50V; AEC Category: Q200; Supplier Part Number 2: 59M6737; Publisher: Texas Instruments; Supplier 2: Newark; Supplier Part Number 3: 71-CRCW0402J-470-E3; Supplier 3: Mouser; Published: 2008-06-26; RoHS: Y; Value1: 5%; MountType: SMT; Supplier 1: Digi-Key; PackageReference: 0402; Tolerance_%: 5%; Res_ohm: 470; SizeArea_mm2: 0.5; CompType: Resistor; LatestRevisionDate: 2017-03-09; PartNumber: CRCW0402470RJNED; AEC Qualified: ?; ComponentLink1Description: Datasheet link; Supplier Part Number 1: 541-470JCT-ND; Technology: Thick Film; ComponentLink1URL: http://www.vishay.com/docs/20035/dcrcwe3.pdf
R31 = CMP-0026825-4: RES, 10 k, 5%, 0.063 W, 0402; Manufacturer: Vishay-Dale; Power_W: 63mW; TempCo: 200 ppm/C; Value_Code: 10k0; U/M: EA; Value: 10k; EIA_Code: E24; SizeX_mm: 1; SizeY_mm: 0.5; SizeZ_mm: 0.6; Value2: 0.063W; VDC_V: 50V; AEC Category: Q200; Supplier Part Number 2: 59M6696; Publisher: Texas Instruments; Supplier 2: Newark; Supplier Part Number 3: 71-CRCW0402J-10K-E3; Supplier 3: Mouser; Published: 2008-06-26; RoHS: Y; Value1: 5%; MountType: SMT; Supplier 1: Digi-Key; PackageReference: 0402; Tolerance_%: 5%; Res_ohm: 10k; SizeArea_mm2: 0.5; CompType: Resistor; LatestRevisionDate: 2017-03-09; PartNumber: CRCW040210K0JNED; AEC Qualified: ?; ComponentLink1Description: Datasheet link; Supplier Part Number 1: 541-10KJCT-ND; Technology: Thick Film; ComponentLink1URL: http://www.vishay.com/docs/20035/dcrcwe3.pdf
R32 = CMP-0026413-2: RES, 4.87 k, 1%, 0.063 W, AEC-Q200 Grade 0, 0402; Manufacturer: Vishay-Dale; Power_W: 63mW; TempCo: 100 ppm/C; Value_Code: 4k87; Value: 4.87k; EIA_Code: E96; SizeX_mm: 1; SizeY_mm: 0.5; SizeZ_mm: 0.6; Value2: 0.063W; AEC Qualified: Y; VDC_V: 50V; AEC Category: Q200; AEC Grade: 0; ComponentLink1URL: http://www.vishay.com/docs/20035/dcrcwe3.pdf; Supplier Part Number 2: 52K7047; Supplier 2: Newark; Supplier Part Number 3: 71-CRCW0402-4.87K-E3; Supplier 3: Mouser; RoHS: E; Value1: 1%; MountType: SMT; Supplier 1: Digi-Key; PackageReference: 0402; Tolerance_%: 1%; Res_ohm: 4.87k; SizeArea_mm2: 0.5; CompType: Resistor; PartNumber: CRCW04024K87FKED; ComponentLink1Description: Datasheet link; Supplier Part Number 1: 541-4.87KLCT-ND; Technology: Thick Film
R33 = CMP-0026824-1: RES, 100, 5%, 0.063 W, 0402; Manufacturer: Vishay-Dale; Power_W: 63mW; TempCo: 200 ppm/C; Value_Code: 100R; U/M: EA; Value: 100; EIA_Code: E24; SizeX_mm: 1; SizeY_mm: 0.5; SizeZ_mm: 0.6; Value2: 0.063W; VDC_V: 50V; AEC Category: Q200; ComponentLink1URL: http://www.vishay.com/docs/20035/dcrcwe3.pdf; Supplier Part Number 2: 59M6700; Publisher: Texas Instruments; Supplier 2: Newark; Supplier Part Number 3: 71-CRCW0402J-100-E3; Supplier 3: Mouser; Published: 2008-06-26; RoHS: Y; Value1: 5%; MountType: SMT; Supplier 1: Digi-Key; PackageReference: 0402; Tolerance_%: 5%; Res_ohm: 100; SizeArea_mm2: 0.5; CompType: Resistor; LatestRevisionDate: 2017-03-09; PartNumber: CRCW0402100RJNED; AEC Qualified: ?; ComponentLink1Description: Datasheet link; Supplier Part Number 1: 541-100JCT-ND; Technology: Thick Film
R35 = CMP-0026946-3: RES, 51, 5%, 0.063 W, AEC-Q200 Grade 0, 0402; Manufacturer: Vishay-Dale; Power_W: 63mW; TempCo: 200 ppm/C; Value_Code: 51R0; Value: 51; EIA_Code: E24; SizeX_mm: 1; SizeY_mm: 0.5; SizeZ_mm: 0.6; Value2: 0.063W; AEC Qualified: Y; VDC_V: 50V; AEC Category: Q200; AEC Grade: 0; Supplier Part Number 2: 72M6804; Supplier 2: Newark; Supplier Part Number 3: 71-CRCW0402J-51-E3; Supplier 3: Mouser; RoHS: E; Value1: 5%; MountType: SMT; Supplier 1: Digi-Key; PackageReference: 0402; Tolerance_%: 5%; Res_ohm: 51; SizeArea_mm2: 0.5; CompType: Resistor; PartNumber: CRCW040251R0JNED; ComponentLink1Description: Datasheet link; Supplier Part Number 1: 541-51JCT-ND; Technology: Thick Film; ComponentLink1URL: http://www.vishay.com/docs/20035/dcrcwe3.pdf
TP1-TP3 = CMP-0055138-1: Test Point, Miniature, Black, TH; Manufacturer: Keystone; CNHeader: FALSE; Green_Lifecycle: Active; Green_REACh: Passed; ContactFinish: Silver; CT: TRUE; ComponentLink1URL: http://www.keyelco.com/userAssets/file/M60-2p60.pdf; Supplier Part Number 2: 534-5001; Publisher: Texas Instruments; Supplier 2: Mouser; Color: Black; RoHS: Y; MountType: TH; Green_EU RoHS-2: Incomplete; Supplier 1: Digi-Key; Green_EU RoHS: Passed; PackageReference: Black Miniature Testpoint; CompType: Test Point; LatestRevisionDate: 26/05/2017; PartNumber: 5001; ComponentLink1Description: Datasheet URL; Supplier Part Number 1: 36-5001-ND
XDS1 = CMP-0077954-1: MSP432E401YTPDT, PDT0128A (TQFP-128); Alternate Manufacturer: Texas Instruments; SizeAreaWB_mm2: 324; SizeZ_mm: 1.2; SizeX_mm: 16; SizeArea_mm2: 256; CompType: IC; AEC Qualified: N; AEC Category: Q200; ComponentLink1URL: http://www.ti.com/lit/ds/symlink/tm4c129encpdt.pdf; Alternate PartNumber: MSP432E401YTPDT; PackageDescription: TQFP-128; MountType: SMT; ComponentLink2URL: TBD; ComponentLink2Description: Product Folder; Manufacturer: Texas Instruments; PackageReference: PDT0128A; SizeY_mm: 16; PartNumber: MSP432E401YTPDTR; ComponentLink1Description: Datasheet Link; PartId: 1
Y3 = CMP-0004635-1: Crystal, 16 MHz, 8pF, SMD; Manufacturer: NDK; TaMax_C: 70°C; TaMin_C: -10°C; Frequency Stability: +/-30ppm; U/M: EA; Frequency_Fixed: 16MHz; ComponentLink1URL: http://www.ndk.com/images/products/catalog/c_NX3225GA-STD-CRG-1_e.pdf; Publisher: Texas Instruments; Supplier 1: Digi-Key; PackageReference: 3.2x0.75x2.5mm; CompType: Crystal; LatestRevisionDate: 18/04/2017; RoHS: Y; Supplier Part Number 1: 644-1157-1-ND; MountType: SMT; PartNumber: NX3225GA-16.000M-STD-CRG-1; ComponentLink1Description: Datasheet Link